# Altium schematic sheet Connectors.SchDoc: Connectors
size A4; Date: Not used; ApprovedBy: Not used; CheckedBy: Not used; Author: Not used; CompanyName: STMicroelectronics; DrawnBy: Not used; Engineer: Not used; Organization: Not used; Address1: Not used; Address2: Not used; Address3: Not used; Address4: Not used; DocumentNumber: Not used; Revision: Not used; SheetNumber: 6; SheetTotal: 8; CurrentTime: Not used; CurrentDate: Not used; Time: Not used; DocumentFullPathAndName: Not used; DocumentName: Not used; ModifiedDate: Not used; ImagePath: Not used; ProjectName: Not used; Application_BuildNumber: Not used
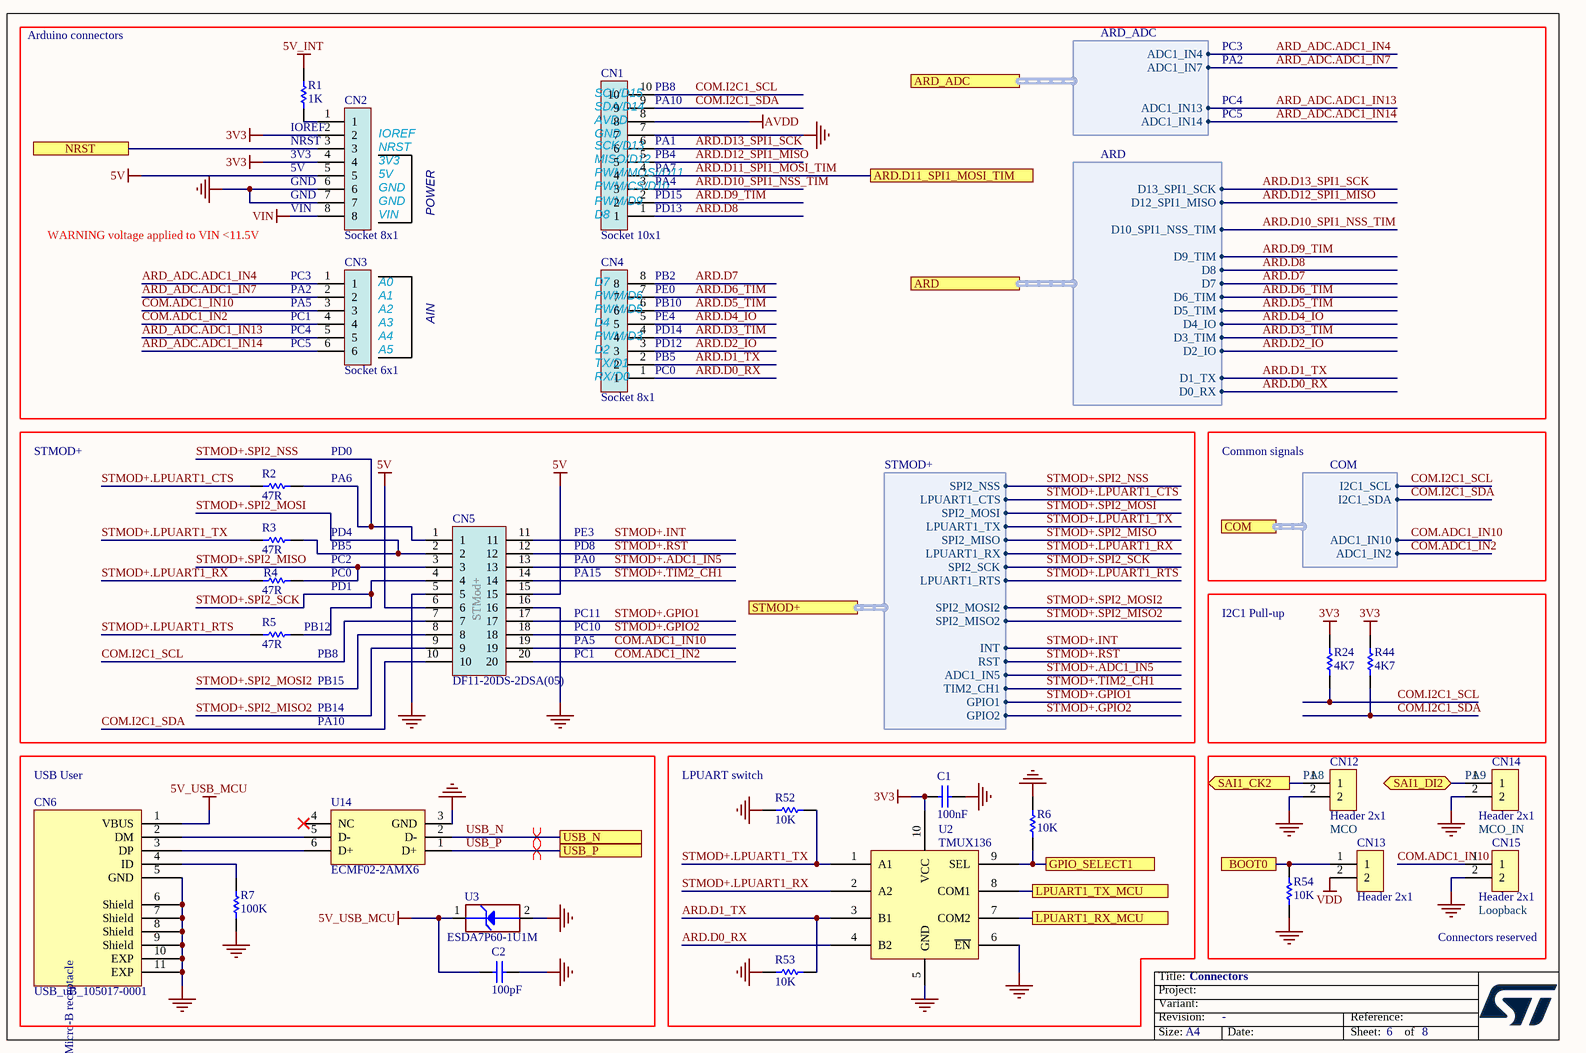
[diagram p0: Connectors.SchDoc]

## Parts
C1  value 100nF  [C0603]  (hidden comment: Capacitor)
C2  value 100pF  [C0603_H0P8]  (hidden comment: Capacitor)
CN1  Socket 10x1  [CON_SAMTEC_SSW-110-22-X-S-VS]
CN2  Socket 8x1  [CON_SAMTEC_SSW-108-22-X-S-VS]
CN3  Socket 6x1  [CON_SAMTEC_SSW-106-22-X-S-VS]
CN4  Socket 8x1  [CON_SAMTEC_SSW-108-22-X-S-VS]
CN5  value DF11-20DS-2DSA(05)  [CON_HRS_DF11-20DS-2DSA-XX_SMT-PCB-SIDE__STMOD+]  (hidden comment: Socket 10X2 STMod+)
CN6  value USB_uB_105017-0001  [CON_USBMICROB_MOLEX_105017-0001_H2P90]  (hidden comment: USB_uB_105017.0001)
CN12  Header 2x1  [CON_LYCONN_313102S141346]
CN13  Header 2x1  [CON_LYCONN_313102S141346]
CN14  Header 2x1  [CON_LYCONN_313102S141346]
CN15  Header 2x1  [CON_LYCONN_313102S141346]
R1  value 1K  [R0402]  (hidden comment: Resistor)
R2  value 47R  [R0402]  (hidden comment: Resistor)
R3  value 47R  [R0402]  (hidden comment: Resistor)
R4  value 47R  [R0402]  (hidden comment: Resistor)
R5  value 47R  [R0402]  (hidden comment: Resistor)
R6  value 10K  [R0402]  (hidden comment: Resistor)
R7  value 100K  [R0402]  (hidden comment: Resistor)
R24  value 4K7  [R0603]  (hidden comment: Resistor)
R44  value 4K7  [R0603]  (hidden comment: Resistor)
R52  value 10K  [R0402]  (hidden comment: Resistor)
R53  value 10K  [R0402]  (hidden comment: Resistor)
R54  value 10K  [R0402]  (hidden comment: Resistor)
U2  TMUX136  [ICC_UQFN10_RSE_R-PUQFN-N10_1P5X2_P050]
U3  value ESDA7P60-1U1M  [ESD_QFN2_1P6X1_P125]  (hidden comment: ESD-TRANSIL)
U14  ECMF02-2AMX6  [ESD_QFN-6L_1P7X1P5_P050]

## Blocks framed on the sheet
I2C1 Pull-up: R24 R44
USB User: C2 CN6 R7 U3 U14
LPUART switch: C1 R6 R52 R53 U2

## Ports
ARD (harness ARD), ARD.D11_SPI1_MOSI_TIM, ARD_ADC (harness ARD_ADC), BOOT0, COM (harness COM), GPIO_SELECT1, LPUART1_RX_MCU, LPUART1_TX_MCU, NRST, SAI1_CK2 (out), SAI1_DI2 (bidir), STMOD+ (harness STMOD+), USB_N, USB_P

## Harnesses
ARD_ADC: ADC1_IN4, ADC1_IN7, ADC1_IN13, ADC1_IN14
ARD: D0_RX, D1_TX, D2_IO, D3_TIM, D4_IO, D5_TIM, D6_TIM, D7, D8, D9_TIM, D10_SPI1_NSS_TIM, D12_SPI1_MISO, D13_SPI1_SCK
STMOD+: SPI2_NSS, LPUART1_CTS, SPI2_MOSI, LPUART1_TX, SPI2_MISO, SPI2_SCK, LPUART1_RX, LPUART1_RTS, SPI2_MOSI2, SPI2_MISO2, INT, RST, ADC1_IN5, TIM2_CH1, GPIO1, GPIO2
COM: I2C1_SCL, I2C1_SDA, ADC1_IN10, ADC1_IN2

## Nets
3V3: C1.2 CN2.2 CN2.4 R24.2 R44.2 U2.10(VCC)
5V: CN2.5 CN5.6 CN5.15
5V_INT: R1.2
5V_USB_MCU: C2.1 CN6.1(VBUS) U3.1(IO1)
AVDD: CN1.8
GND: C1.1 C2.2 CN1.7 CN2.6 CN2.7 CN5.5 CN5.16 CN6.5(GND) CN6.6(Shield) CN6.7(Shield) CN6.8(Shield) CN6.9(Shield) CN6.10(EXP) CN6.11(EXP) CN12.2 CN14.2 CN15.2 R6.2 R7.1 R52.1 R53.1 R54.1 U2.5(GND) U2.6(~{EN}) U3.2(GND) U14.3(GND)
VDD: CN13.2
VIN: CN2.8
ARD.D0_RX: CN4.1 U2.4(B2) ; port ARD.D0_RX
ARD.D1_TX: CN4.2 R53.2 U2.3(B1) ; port ARD.D1_TX
ARD.D2_IO: CN4.3 ; port ARD.D2_IO
ARD.D3_TIM: CN4.4 ; port ARD.D3_TIM
ARD.D4_IO: CN4.5 ; port ARD.D4_IO
ARD.D5_TIM: CN4.6 ; port ARD.D5_TIM
ARD.D6_TIM: CN4.7 ; port ARD.D6_TIM
ARD.D7: CN4.8 ; port ARD.D7
ARD.D8: CN1.1 ; port ARD.D8
ARD.D9_TIM: CN1.2 ; port ARD.D9_TIM
ARD.D10_SPI1_NSS_TIM: CN1.3 ; port ARD.D10_SPI1_NSS_TIM
ARD.D11_SPI1_MOSI_TIM: CN1.4 ; port ARD.D11_SPI1_MOSI_TIM
ARD.D12_SPI1_MISO: CN1.5 ; port ARD.D12_SPI1_MISO
ARD.D13_SPI1_SCK: CN1.6 ; port ARD.D13_SPI1_SCK
ARD_ADC.ADC1_IN4: CN3.1 ; port ARD_ADC.ADC1_IN4
ARD_ADC.ADC1_IN7: CN3.2 ; port ARD_ADC.ADC1_IN7
ARD_ADC.ADC1_IN13: CN3.5 ; port ARD_ADC.ADC1_IN13
ARD_ADC.ADC1_IN14: CN3.6 ; port ARD_ADC.ADC1_IN14
BOOT0: CN13.1 R54.2 ; port BOOT0
COM.ADC1_IN2: CN3.4 CN5.20 ; port COM.ADC1_IN2
COM.ADC1_IN10: CN3.3 CN5.19 CN15.1 ; port COM.ADC1_IN10
COM.I2C1_SCL: CN1.10 CN5.7 R24.1 ; port COM.I2C1_SCL
COM.I2C1_SDA: CN1.9 CN5.10 R44.1 ; port COM.I2C1_SDA
GPIO_SELECT1: R6.1 U2.9(SEL) ; port GPIO_SELECT1
LPUART1_RX_MCU: U2.7(COM2) ; port LPUART1_RX_MCU
LPUART1_TX_MCU: U2.8(COM1) ; port LPUART1_TX_MCU
NRST: CN2.3 ; port NRST
SAI1_CK2: CN12.1 ; port SAI1_CK2
SAI1_DI2: CN14.1 ; port SAI1_DI2
STMOD+.ADC1_IN5: CN5.13 ; port STMOD+.ADC1_IN5
STMOD+.GPIO1: CN5.17 ; port STMOD+.GPIO1
STMOD+.GPIO2: CN5.18 ; port STMOD+.GPIO2
STMOD+.INT: CN5.11 ; port STMOD+.INT
STMOD+.LPUART1_CTS: R2.1 ; port STMOD+.LPUART1_CTS
STMOD+.LPUART1_RTS: R5.1 ; port STMOD+.LPUART1_RTS
STMOD+.LPUART1_RX: R4.1 U2.2(A2) ; port STMOD+.LPUART1_RX
STMOD+.LPUART1_TX: R3.1 R52.2 U2.1(A1) ; port STMOD+.LPUART1_TX
STMOD+.RST: CN5.12 ; port STMOD+.RST
STMOD+.SPI2_MISO: CN5.3 R4.2 ; port STMOD+.SPI2_MISO
STMOD+.SPI2_MISO2: CN5.9 ; port STMOD+.SPI2_MISO2
STMOD+.SPI2_MOSI: CN5.2 R3.2 ; port STMOD+.SPI2_MOSI
STMOD+.SPI2_MOSI2: CN5.8 ; port STMOD+.SPI2_MOSI2
STMOD+.SPI2_NSS: CN5.1 R2.2 ; port STMOD+.SPI2_NSS
STMOD+.SPI2_SCK: CN5.4 R5.2 ; port STMOD+.SPI2_SCK
STMOD+.TIM2_CH1: CN5.14 ; port STMOD+.TIM2_CH1
USB_N: U14.2(D-) ; port USB_N
USB_P: U14.1(D+) ; port USB_P
NetCN2_1: CN2.1 R1.1
NetCN6_2: CN6.2(DM) U14.5(D-)
NetCN6_3: CN6.3(DP) U14.6(D+)
NetCN6_4: CN6.4(ID) R7.2

Not connected (* = marked no-connect by the designer): U14 4(NC)*

## Layout directives
differential pair: USB_N, USB_P

## Notes on the sheet
- Arduino connectors
- PC3
- (near CN1) SDA/D14
- (near CN1) SCL/D15
- (near CN1) AVDD
- (near CN1) PB8
- (near CN1) PA10
- PC4
- PA2
- PC5
- IOREF
- NRST
- 3V3
- 5V
- (near CN2) GND
- (near CN2) IOREF
- (near CN2) NRST
- (near CN2) 3V3
- (near CN2) 5V
- (near CN1) PWM/CS/D10
- (near CN1) SCK/D13
- (near CN1) MISO/D12
- (near CN1) PWM/MOSI/D11
- (near CN1) GND
- (near CN1) PA1
- (near CN1) PB4
- (near CN1) PA7
- (near CN1) PA4
- WARNING voltage applied to VIN <11.5V
- (near CN2) VIN
- POWER
- (near CN1) D8
- (near CN1) PWM/D9
- (near CN1) PD15
- (near CN1) PD13
- (near CN3) PC3
- (near CN3) PA2
- (near CN3) PA5
- (near CN3) PC1
- (near CN3) A0
- (near CN3) A1
- (near CN3) A2
- AIN
- (near CN4) PWM/D5
- (near CN4) PWM/D6
- (near CN4) D7
- (near CN4) PB2
- (near CN4) PE0
- (near CN4) PB10
- (near CN4) PE4
- (near CN3) PC4
- (near CN3) PC5
- (near CN3) A3
- (near CN3) A4
- (near CN3) A5
- (near CN4) RX/D0
- (near CN4) TX/D1
- (near CN4) D2
- (near CN4) D4
- (near CN4) PWM/D3
- (near CN4) PD14
- (near CN4) PD12
- (near CN4) PB5
- (near CN4) PC0
- STMOD+
- (near R2) PD0
- Common signals
- (near R2) PA6
- PD4
- PB5
- PC2
- PC0
- PD1
- PE3
- PD8
- PA0
- PA15
- (near R5) PB12
- (near R5) PB8
- PC11
- PA5
- PC10
- PC1
- (near R5) PB15
- PB14
- PA10
- (near CN12) PA8
- (near CN14) PA9
- MCO
- MCO_IN
- (near CN15) Loopback
- Connectors reserved
- Title:
- Project:
- Size:
- Revision:
- Variant:
- -
- Date:
- Reference:
- Sheet:
- of
- (in symbol MCD-00028) USB_Micro-B receptacle
- (in symbol MCD-02116) STMod+

## Library data of the parts
C1 = MCD-02119: Capacitor, MLCC, 100nF, 6V3, X5R, 10%, 0603, T=0,8mm; Part_Preference: Recommended; Manufacturer: KEMET; Manufacturer_Part_Number: C0603C104K9PACTU; Internal_Part_Number: MCD-02119; Status: Checked; Part_Type: Capacitor; Alternate_Manufacturer: N/A; Alternate_Manufacturer_Part_Number: N/A; Package: C0603; ComponentLink1URL: http://tunmcdsvn.tun.st.com/Component_Datasheet_Library/Trunk/Capacitors/KEMET_Capacitor_X5R-series/KEMET_Capacitor_C0603C104K9PACTU; Order_Code_Digikey: N/A; Order_Code_Farnell: 2941311; Order_Code_RS: N/A
C2 = MCD-01648: Capacitor,MLCC,100pF 50V,NPO,+/-5%, 0603,T=0,8mm; Manufacturer_Part_Number: CC0603JRNPO9BN101; Manufacturer: YAGEO; Part_Preference: Recommended; Order_Code_RS: 625-0267; Internal_Part_Number: MCD-01648; Status: Released; Part_Type: Capacitor; Package: C0603; ComponentLink1URL: http://tunmcdsvn.tun.st.com/Component_Datasheet_Library/Trunk/Capacitors/Yageo_UPY-GP_NP0_16V-to-50V/YAGEO_NP0_UPY-GP_NP0_16V-to-50V_16.pdf; Order_Code_Digikey: 311-1069-1-ND; Order_Code_Farnell: 722080
CN1 = MCD-00301: Socket, 10x1, 2.54mm, VR, SMT, Height 9.78mm; Part_Type: Connector; Manufacturer_Part_Number: SSW-110-22-L-S-VS; Manufacturer: SAMTEC; Part_Preference: Recommended; Internal_Part_Number: MCD-00301; Value: Socket 10x1; Status: Checked; ComponentLink1URL: http://tunmcdsvn.tun.st.com/Component_Datasheet_Library/Trunk/Connectors/Samtec_SSW_smt_series
CN2 CN4 = MCD-00300: Socket, 8x1, 2.54mm, VR, SMT, Height 9.78mm; Part_Type: Connector; Manufacturer_Part_Number: SSW-108-22-L-S-VS; Manufacturer: SAMTEC; Part_Preference: Recommended; Internal_Part_Number: MCD-00300; Value: Socket 8x1; Status: Checked; ComponentLink1URL: http://tunmcdsvn.tun.st.com/Component_Datasheet_Library/Trunk/Connectors/Samtec_SSW_smt_series
CN3 = MCD-00299: Socket, 6x1, 2.54mm, VR, SMT, Height 9.78mm; Part_Type: Connector; Manufacturer_Part_Number: SSW-106-22-L-S-VS; Manufacturer: SAMTEC; Part_Preference: Recommended; Internal_Part_Number: MCD-00299; Value: Socket 6x1; Status: Checked; ComponentLink1URL: http://tunmcdsvn.tun.st.com/Component_Datasheet_Library/Trunk/Connectors/Samtec_SSW_smt_series
CN5 = MCD-02116: Socket, 10x2, 2mm, Straight,SMT, height 9.2mm; Part_Type: Connector; Manufacturer_Part_Number: DF11-20DS-2DSA(06); Manufacturer: HIROSE; Part_Preference: Recommended; Order_Code_RS: 688-8900; Internal_Part_Number: MCD-02116; Status: Checked; Alternate_Manufacturer_Part_Number: N/A; Alternate_Manufacturer: N/A; Package: DIP socket; ComponentLink1URL: http://tunmcdsvn.tun.st.com/Component_Datasheet_Library/Trunk/Connectors/Hirose_Connector_DF11-series_DF11-20DS-2DSA; Order_Code_Digikey: H10190-ND; Order_Code_Farnell: 2724913
CN6 = MCD-00028: USB-MICRO-B, 0.65mm, RA, SMT, Bottom Mount,; Manufacturer_Part_Number: 1050170001; Manufacturer: MOLEX; Part_Type: Connector; Part_Preference: Recommended; Internal_Part_Number: MCD-00028; Status: Released; ComponentLink1URL: http://tunmcdsvn.tun.st.com/Component_Datasheet_Library/Trunk/Connectors/Molex_Connector-USB-microB_105017-0001
CN12-CN15 = MCD-01668: Header 2x1, 2.54mm, VR, TH, height 5.84mm/5.08 mm, height total 13.46 mm; Part_Type: Connector; Manufacturer_Part_Number: 313102S141346; Manufacturer: LYCONN; Part_Preference: Recommended; Internal_Part_Number: MCD-01668; Value: Header 2x1; Status: Released; ComponentLink1URL: http://tunmcdsvn.tun.st.com/Component_Datasheet_Library/Trunk/Connectors/LYCONN_31XXX_2.54mm_L13.46mm/LYCONN_31XXX_2.54mm_L13.46mm.pdf
R1 = MCD-00061: Resistor,1K,0402,1%,1/16W; Manufacturer_Part_Number: RC0402FR-071KL; Manufacturer: YAGEO; Part_Preference: Recommended; Internal_Part_Number: MCD-00061; Status: Released; Part_Type: Resistor; Package: R0402; ComponentLink1URL: http://tunmcdsvn.tun.st.com/Component_Datasheet_Library/Trunk/Resistors/Yageo_Resistor_RC0402-series; Order_Code_Digikey: 311-1.00KLRCT-ND; Order_Code_Farnell: 9239235; Order_Code_RS: N/A
R2-R5 = MCD-00481: Resistor,47R,0402,1%,1/16W; Manufacturer_Part_Number: RC0402FR-0747RL; Manufacturer: YAGEO; Part_Preference: Recommended; Internal_Part_Number: MCD-00481; Status: Released; Part_Type: Resistor; Package: R0402; ComponentLink1URL: http://tunmcdsvn.tun.st.com/Component_Datasheet_Library/Trunk/Resistors/Yageo_Resistor_RC0402-series; Order_Code_Digikey: 311-47.0LRCT-ND; Order_Code_Farnell: 9239073; Order_Code_RS: N/A
R6 R52-R54 = MCD-00053: Resistor,10K,0402,1%,1/16W; Manufacturer_Part_Number: RC0402FR-0710KL; Manufacturer: YAGEO; BMS_Part_Number: 9131590; Part_Preference: Recommended; Internal_Part_Number: MCD-00053; Status: Released; Part_Type: Resistor; Package: R0402; ComponentLink1URL: http://tunmcdsvn.tun.st.com/Component_Datasheet_Library/Trunk/Resistors/Yageo_Resistor_RC0402-series; Order_Code_Digikey: 311-10.0KLRCT-ND; Order_Code_Farnell: 9239359; Order_Code_RS: N/A
R7 = MCD-00059: Resistor,100K,0402,1%,1/16W; Manufacturer_Part_Number: RC0402FR-07100KL; Manufacturer: YAGEO; Alternate_Manufacturer_Part_Number: RT0402FRE07100KL; Part_Preference: Recommended; Internal_Part_Number: MCD-00059; Alternate_Manufacturer: YAGEO; Status: Released; Part_Type: Resistor; ComponentLink1URL: http://tunmcdsvn.tun.st.com/Component_Datasheet_Library/Trunk/Resistors/Yageo_Resistor_RC0402-series; Package: R0402; Order_Code_Digikey: 311-100KLRTR-ND; Order_Code_Farnell: 2421891; Order_Code_RS: N/A
R24 R44 = MCD-00219: Resistor,4K7,0603,1%,1/10W; Manufacturer_Part_Number: RC0603FR-074K7L; Manufacturer: YAGEO; Part_Preference: Recommended; Internal_Part_Number: MCD-00219; Status: Released; Part_Type: Resistor; Package: R0603; ComponentLink1URL: http://tunmcdsvn.tun.st.com/Component_Datasheet_Library/Trunk/Resistors/Yageo_Resistor_RC0603-series; Order_Code_Digikey: 311-4.70KHRCT-ND; Order_Code_Farnell: 9238565; Order_Code_RS: N/A
U2 = MCD-01847: 6-GHz, 2-Channel, 2:1 Switch, With Power-off Isolation; Part_Type: IC; Manufacturer: TEXAS INSTRUMENTS; Part_Preference: Recommended; Internal_Part_Number: MCD-01847; Status: Checked; Manufacturer_Part_Number: TMUX136; ComponentLink1URL: http://tunmcdsvn.tun.st.com/Component_Datasheet_Library/Trunk/IC/TI_2-channel_switch_TMUX136; Value: TMUX136; Package: UQFN-10; Order_Code_Digikey: 296-47396-1-ND; Order_Code_Farnell: 2802932RL; Order_Code_RS: N/A
U3 = MCD-00251: High power transient voltage suppressor, 7V breakdown; Part_Type: Diode; Manufacturer: STMICROELECTRONICS; BMS_Part_Number: 9179042; Part_Preference: Recommended; Manufacturer_HQ_COO: EU; Internal_Part_Number: MCD-00251; Status: Released; Manufacturer_Part_Number: ESDA7P60-1U1M; ComponentLink1URL: http://tunmcdsvn.tun.st.com/Component_Datasheet_Library/Trunk/Diodes/STM_ESD_ESDA7P60-1U1M
U14 = MCD-00649: Common mode filter with ESD protection for USB 2.0 interface; Part_Type: Diode; Manufacturer: STMICROELECTRONICS; BMS_Part_Number: 9151138; Part_Preference: Recommended; Manufacturer_HQ_COO: EU; Internal_Part_Number: MCD-00649; Value: ECMF02-2AMX6; Status: Released; Manufacturer_Part_Number: ECMF02-2AMX6; ComponentLink1URL: http://tunmcdsvn.tun.st.com/Component_Datasheet_Library/Trunk/Diodes/STM_ESD_ECMF02-2AMX6